# Altium project ADCPrint.PrjPcb
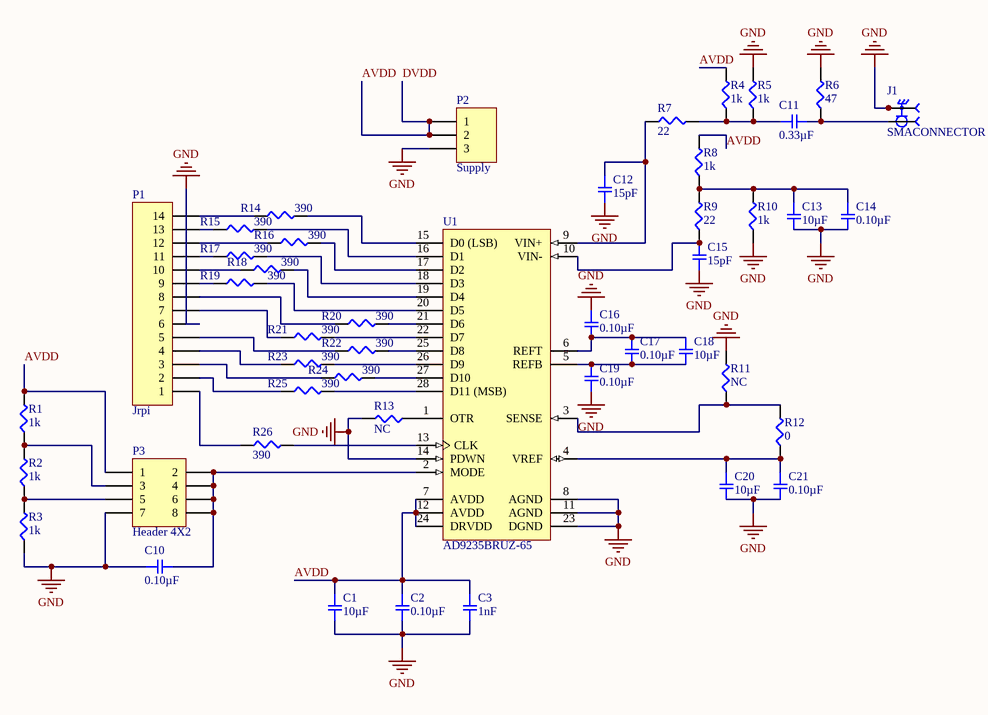
[diagram p0: Sheet1.SchDoc]
1 sheet, 46 parts. Net scope: global (net labels, ports and power ports of the same name join across sheets).
Board file: PCB1.PcbDoc

## Sheet Sheet1.SchDoc
size A4

### Parts
C1  10µF  [SMD-0603C]
C2  0.10µF  [SMD-0603C]
C3  1nF  [SMD-0603C]
C10  0.10µF  [SMD-0603C]
C11  0.33µF  [SMD-0603C]
C12  15pF  [SMD-0603C]
C13  10µF  [SMD-0603C]
C14  0.10µF  [SMD-0603C]
C15  15pF  [SMD-0603C]
C16  0.10µF  [SMD-0603C]
C17  0.10µF  [SMD-0603C]
C18  10µF  [SMD-0603C]
C19  0.10µF  [SMD-0603C]
C20  10µF  [SMD-0603C]
C21  0.10µF  [SMD-0603C]
J1  SMACONNECTOR  [LPRS_SMACONNECTOR]
P1  Jrpi  [HDR1X14]
P2  Supply  [HDR1X3]
P3  Header 4X2  [HDR2X4]
R1  1k  [SMD-0603-RES]
R2  1k  [SMD-0603-RES]
R3  1k  [SMD-0603-RES]
R4  1k  [SMD-0603-RES]
R5  1k  [SMD-0603-RES]
R6  47  [SMD-0603-RES]
R7  22  [SMD-0603-RES]
R8  1k  [SMD-0603-RES]
R9  22  [SMD-0603-RES]
R10  1k  [SMD-0603-RES]
R11  NC  [SMD-0603-RES]
R12  0  [SMD-0603-RES]
R13  NC  [SMD-0603-RES]
R14  390  [SMD-0603-RES]
R15  390  [SMD-0603-RES]
R16  390  [SMD-0603-RES]
R17  390  [SMD-0603-RES]
R18  390  [SMD-0603-RES]
R19  390  [SMD-0603-RES]
R20  390  [SMD-0603-RES]
R21  390  [SMD-0603-RES]
R22  390  [SMD-0603-RES]
R23  390  [SMD-0603-RES]
R24  390  [SMD-0603-RES]
R25  390  [SMD-0603-RES]
R26  390  [SMD-0603-RES]
U1  AD9235BRUZ-65  [RU-28_M]

### Nets
GND: C1.2 C2.2 C3.2 C10.1 C12.2 C13.2 C14.2 C15.2 C16.1 C19.2 C20.2 C21.2 J1.2 J1.3 J1.4 J1.5 P1.6 P2.3 P3.7 R3.1 R5.2 R6.2 R10.1 R11.2 R13.2 U1.8(AGND) U1.11(AGND) U1.14(PDWN) U1.23(DGND)
AVDD: C1.1 C2.1 C3.1 P2.1 P2.2 P3.1 R1.2 R4.2 R8.2 U1.7(AVDD) U1.12(AVDD) U1.24(DRVDD)  [also labelled DVDD]
NetC10_2: C10.2 P3.2 P3.4 P3.6 P3.8 U1.2(MODE)
NetC11_1: C11.1 R4.1 R5.1 R7.2
NetC11_2: C11.2 J1.1 R6.1
NetC12_1: C12.1 R7.1 U1.9(VIN+)
NetC13_1: C13.1 C14.1 R8.1 R9.2 R10.2
NetC15_1: C15.1 R9.1 U1.10(VIN-)
NetC16_2: C16.2 C17.1 C18.1 U1.6(REFT)
NetC17_2: C17.2 C18.2 C19.1 U1.5(REFB)
NetC20_1: C20.1 C21.1 R12.1 U1.4(VREF)
NetP1_1: P1.1 R26.1
NetP1_2: P1.2 R25.1
NetP1_3: P1.3 R24.1
NetP1_4: P1.4 R23.1
NetP1_5: P1.5 R22.1
NetP1_7: P1.7 R21.1
NetP1_8: P1.8 R20.1
NetP1_9: P1.9 R19.1
NetP1_10: P1.10 R18.1
NetP1_11: P1.11 R17.1
NetP1_12: P1.12 R16.1
NetP1_13: P1.13 R15.1
NetP1_14: P1.14 R14.1
NetP3_3: P3.3 R1.1 R2.2
NetP3_5: P3.5 R2.1 R3.2
NetR11_1: R11.1 R12.2 U1.3(SENSE)
NetR13_1: R13.1 U1.1(OTR)
NetR14_2: R14.2 U1.15(D0_(LSB))
NetR15_2: R15.2 U1.16(D1)
NetR16_2: R16.2 U1.17(D2)
NetR17_2: R17.2 U1.18(D3)
NetR18_2: R18.2 U1.19(D4)
NetR19_2: R19.2 U1.20(D5)
NetR20_2: R20.2 U1.21(D6)
NetR21_2: R21.2 U1.22(D7)
NetR22_2: R22.2 U1.25(D8)
NetR23_2: R23.2 U1.26(D9)
NetR24_2: R24.2 U1.27(D10)
NetR25_2: R25.2 U1.28(D11_(MSB))
NetR26_2: R26.2 U1.13(CLK)

### Library data of the parts
C1 C13 C18 C20 = GRM185R60J106ME15D: CAP CER 10UF 6.3V X5R 0603; Manufacturer: Murata Electronics North America; Factory Stock: 0; Unit Price (USD): 0.36; Minimum Quantity: 1; Tolerance: ±20%; Datasheets: http://www.murata.com/~/media/webrenewal/support/library/catalog/products/capacitor/mlcc/c02e.pdf; Image: //media.digikey.com/Renders/Murata%20Renders/ZRB-SERIES-0402.jpg; Digi-Key Part Number: 490-10467-1-ND; Part Number: GRM185R60J106ME15D; Quantity Available: 25068; @ qty: 0; Packaging: Cut Tape (CT); Series: GRM; Part Status: Active; Value: 10µF; Voltage: 6.3V; Temperature Coefficient: X5R; Operating Temperature: -55°C ~ 85°C; Features: Derating Recommended; Ratings: -; Applications: General Purpose; Mounting Type: Surface Mount, MLCC; Package / Case: 0603 (1608 Metric); Size / Dimension: 0.063" L x 0.031" W (1.60mm x 0.80mm); Height - Seated (Max): -; Thickness (Max): 0.022" (0.55mm); Lead Spacing: -; Lead Style: -
C2 C10 C14 C16 C17 C19 C21 = GCJ188R71C104KA01D: CAP CER 0.1UF 16V X7R 0603; Manufacturer: Murata Electronics North America; Factory Stock: 0; Unit Price (USD): 0.21; Minimum Quantity: 1; Tolerance: ±10%; Datasheets: http://www.murata.com/~/media/webrenewal/support/library/catalog/products/capacitor/mlcc/c03e.ashx; Image: //media.digikey.com/Renders/Murata%20Renders/0603%28LQG18%29.jpg; Digi-Key Part Number: 490-5796-1-ND; Part Number: GCJ188R71C104KA01D; Quantity Available: 22473; @ qty: 0; Packaging: Cut Tape (CT); Series: GCJ; Part Status: Active; Value: 0.10µF; Voltage: 16V; Temperature Coefficient: X7R; Operating Temperature: -55°C ~ 125°C; Features: Soft Termination; Ratings: AEC-Q200; Applications: Automotive, Boardflex Sensitive; Mounting Type: Surface Mount, MLCC; Package / Case: 0603 (1608 Metric); Size / Dimension: 0.063" L x 0.031" W (1.60mm x 0.80mm); Height - Seated (Max): -; Thickness (Max): 0.035" (0.90mm); Lead Spacing: -; Lead Style: -
C3 = GCJ188R71H102KA01D: CAP CER 1000PF 50V X7R 0603; Manufacturer: Murata Electronics North America; Factory Stock: 0; Unit Price (USD): 0.16; Minimum Quantity: 1; Tolerance: ±10%; Datasheets: http://www.murata.com/~/media/webrenewal/support/library/catalog/products/capacitor/mlcc/c03e.ashx; Image: //media.digikey.com/Renders/Murata%20Renders/0603%28LQG18%29.jpg; Digi-Key Part Number: 490-5768-1-ND; Part Number: GCJ188R71H102KA01D; Quantity Available: 21434; @ qty: 0; Packaging: Cut Tape (CT); Series: GCJ; Part Status: Active; Value: 1000pF; Voltage: 50V; Temperature Coefficient: X7R; Operating Temperature: -55°C ~ 125°C; Features: Soft Termination; Ratings: AEC-Q200; Applications: Automotive, Boardflex Sensitive; Mounting Type: Surface Mount, MLCC; Package / Case: 0603 (1608 Metric); Size / Dimension: 0.063" L x 0.031" W (1.60mm x 0.80mm); Height - Seated (Max): -; Thickness (Max): 0.031" (0.80mm); Lead Spacing: -; Lead Style: -
C11 = GCM188R71C334KA37D: CAP CER 0.33UF 16V X7R 0603; Manufacturer: Murata Electronics North America; Factory Stock: 0; Unit Price (USD): 0.19; Minimum Quantity: 1; Tolerance: ±10%; Datasheets: http://www.murata.com/~/media/webrenewal/support/library/catalog/products/capacitor/mlcc/c03e.ashx; Image: //media.digikey.com/Renders/Murata%20Renders/0603%28GCM188%29.jpg; Digi-Key Part Number: 490-6050-1-ND; Part Number: GCM188R71C334KA37D; Quantity Available: 10234; @ qty: 0; Packaging: Cut Tape (CT); Series: GCM; Part Status: Active; Value: 0.33µF; Voltage: 16V; Temperature Coefficient: X7R; Operating Temperature: -55°C ~ 125°C; Features: -; Ratings: AEC-Q200; Applications: Automotive; Mounting Type: Surface Mount, MLCC; Package / Case: 0603 (1608 Metric); Size / Dimension: 0.063" L x 0.031" W (1.60mm x 0.80mm); Height - Seated (Max): -; Thickness (Max): 0.035" (0.90mm); Lead Spacing: -; Lead Style: -
C12 C15 = GCM1885C1H150JA16D: CAP CER 15PF 50V NP0 0603; Manufacturer: Murata Electronics North America; Factory Stock: 0; Unit Price (USD): 0.1; Minimum Quantity: 1; Tolerance: ±5%; Temperature Coefficient: C0G, NP0; Datasheets: http://www.murata.com/~/media/webrenewal/support/library/catalog/products/capacitor/mlcc/c03e.ashx; Image: //media.digikey.com/Renders/Murata%20Renders/0603%28GCM188%29.jpg; Digi-Key Part Number: 490-4957-1-ND; Part Number: GCM1885C1H150JA16D; Quantity Available: 99209; @ qty: 0; Packaging: Cut Tape (CT); Series: GCM; Part Status: Active; Value: 15pF; Voltage: 50V; Operating Temperature: -55°C ~ 125°C; Features: -; Ratings: AEC-Q200; Applications: Automotive; Mounting Type: Surface Mount, MLCC; Package / Case: 0603 (1608 Metric); Size / Dimension: 0.063" L x 0.031" W (1.60mm x 0.80mm); Height - Seated (Max): -; Thickness (Max): 0.035" (0.90mm); Lead Spacing: -; Lead Style: -
J1 = SMACONNECTOR: SMA female RF coaxial connector for SMA male RF antennas.; Package: None; Price: None; Value: *; MP: SMACONNECTOR; Availability: Unavailable
P1 = Header 14: Header, 14-Pin; LatestRevisionDate: 17-Jul-2002; LatestRevisionNote: Re-released for DXP Platform.; Publisher: Altium Limited
P2 = Header 3: Header, 3-Pin; LatestRevisionDate: 17-Jul-2002; LatestRevisionNote: Re-released for DXP Platform.; Publisher: Altium Limited
P3 = Header 4X2: Header, 4-Pin, Dual row; LatestRevisionDate: 17-Jul-2002; LatestRevisionNote: Re-released for DXP Platform.; Publisher: Altium Limited
R1-R5 R8 R10 = ERJ-3EKF1001V: RES SMD 1K OHM 1% 1/10W 0603; Manufacturer: Panasonic Electronic Components; Factory Stock: 0; Unit Price (USD): 0.00379; @ qty: 1500; Minimum Quantity: 1; Power (Watts): 0.1W, 1/10W; Temperature Coefficient: ±100ppm/°C; Part Number: ERJ-3EKF1001V; Datasheets: http://industrial.panasonic.com/www-cgi/jvcr13pz.cgi?E+PZ+3+AOA0002+ERJ3EKF1001V+7+WW; Image: //media.digikey.com/Photos/Panasonic%20Photos/MFG_ERJ-P6W%20Series.jpg; Digi-Key Part Number: P1.00KHCT-ND; Quantity Available: 5218845; Packaging: Cut Tape (CT); Series: ERJ; Part Status: Active; Value: 1k; Tolerance: ±1%; Composition: Thick Film; Features: Automotive AEC-Q200; Operating Temperature: -55°C ~ 155°C; Package / Case: 0603 (1608 Metric); Supplier Device Package: 0603; Size / Dimension: 0.063" L x 0.031" W (1.60mm x 0.80mm); Height - Seated (Max): 0.022" (0.55mm); Number of Terminations: 2; Failure Rate: -
R6 = ERJ-PA3F47R0V: RES SMD 47 OHM 1% 1/4W 0603; Manufacturer: Panasonic Electronic Components; Factory Stock: 0; Unit Price (USD): 0.02372; @ qty: 1500; Minimum Quantity: 1; Power (Watts): 0.25W, 1/4W; Temperature Coefficient: ±100ppm/°C; Part Number: ERJ-PA3F47R0V; Datasheets: https://industrial.panasonic.com/cdbs/www-data/pdf/RDA0000/AOA0000C243.pdf; Image: //media.digikey.com/Photos/Panasonic%20Photos/MFG_ERJ-P6W%20Series.jpg; Digi-Key Part Number: P47.00BYCT-ND; Quantity Available: 13707; Packaging: Cut Tape (CT); Series: ERJ; Part Status: Active; Value: 47; Tolerance: ±1%; Composition: Thick Film; Features: Automotive AEC-Q200, Pulse Withstanding; Operating Temperature: -55°C ~ 155°C; Package / Case: 0603 (1608 Metric); Supplier Device Package: 0603; Size / Dimension: 0.063" L x 0.031" W (1.60mm x 0.80mm); Height - Seated (Max): 0.022" (0.55mm); Number of Terminations: 2; Failure Rate: -
R7 R9 = ERJ-3GEYJ220V: RES SMD 22 OHM 5% 1/10W 0603; Manufacturer: Panasonic Electronic Components; Factory Stock: 0; Unit Price (USD): 0.00321; @ qty: 1500; Minimum Quantity: 1; Power (Watts): 0.1W, 1/10W; Temperature Coefficient: ±200ppm/°C; Part Number: ERJ-3GEYJ220V; Datasheets: http://industrial.panasonic.com/www-cgi/jvcr13pz.cgi?E+PZ+3+AOA0001+ERJ3GEYJ220V+7+WW; Image: //media.digikey.com/Photos/Panasonic%20Photos/MFG_ERJ-P6W%20Series.jpg; Digi-Key Part Number: P22GCT-ND; Quantity Available: 349892; Packaging: Cut Tape (CT); Series: ERJ; Part Status: Active; Value: 22; Tolerance: ±5%; Composition: Thick Film; Features: Automotive AEC-Q200; Operating Temperature: -55°C ~ 155°C; Package / Case: 0603 (1608 Metric); Supplier Device Package: 0603; Size / Dimension: 0.063" L x 0.031" W (1.60mm x 0.80mm); Height - Seated (Max): 0.022" (0.55mm); Number of Terminations: 2; Failure Rate: -
R11 R13 = ERJ-3BWFR020V: RES SMD 0.02 OHM 1% 1/3W 0603; Manufacturer: Panasonic Electronic Components; Factory Stock: 0; Unit Price (USD): 0.07040; @ qty: 1500; Minimum Quantity: 1; Value: 0.02; Power (Watts): 0.333W, 1/3W; Temperature Coefficient: ±250ppm/°C; Part Number: ERJ-3BWFR020V; Datasheets: https://industrial.panasonic.com/cdbs/www-data/pdf/RDA0000/AOA0000C239.pdf; Image: //media.digikey.com/Photos/Panasonic%20Photos/MFG_ERJ-P6W%20Series.jpg; Digi-Key Part Number: P17461CT-ND; Quantity Available: 4366; Packaging: Cut Tape (CT); Series: ERJ; Part Status: Active; Tolerance: ±1%; Composition: Thick Film; Features: Automotive AEC-Q200, Current Sense; Operating Temperature: -55°C ~ 155°C; Package / Case: 0603 (1608 Metric); Supplier Device Package: 0603; Size / Dimension: 0.063" L x 0.031" W (1.60mm x 0.80mm); Height - Seated (Max): 0.026" (0.65mm); Number of Terminations: 2; Failure Rate: -
R12 = ERJ-3BWFR020V: RES SMD 0.02 OHM 1% 1/3W 0603; Manufacturer: Panasonic Electronic Components; Unit Price (USD): 0.07040; @ qty: 1500; Minimum Quantity: 1; Value: 0.02; Power (Watts): 0.333W, 1/3W; Temperature Coefficient: ±250ppm/°C; Part Number: ERJ-3BWFR020V; Datasheets: https://industrial.panasonic.com/cdbs/www-data/pdf/RDA0000/AOA0000C239.pdf; Image: //media.digikey.com/Photos/Panasonic%20Photos/MFG_ERJ-P6W%20Series.jpg; Digi-Key Part Number: P17461CT-ND; Quantity Available: 4366; Factory Stock: 0; Packaging: Cut Tape (CT); Series: ERJ; Part Status: Active; Tolerance: ±1%; Composition: Thick Film; Features: Automotive AEC-Q200, Current Sense; Operating Temperature: -55°C ~ 155°C; Package / Case: 0603 (1608 Metric); Supplier Device Package: 0603; Size / Dimension: 0.063" L x 0.031" W (1.60mm x 0.80mm); Height - Seated (Max): 0.026" (0.65mm); Number of Terminations: 2; Failure Rate: -
R14-R26 = ERJ-3EKF3900V: RES SMD 390 OHM 1% 1/10W 0603; Manufacturer: Panasonic Electronic Components; Factory Stock: 0; Unit Price (USD): 0.00379; @ qty: 1500; Minimum Quantity: 1; Power (Watts): 0.1W, 1/10W; Temperature Coefficient: ±100ppm/°C; Part Number: ERJ-3EKF3900V; Datasheets: http://industrial.panasonic.com/www-cgi/jvcr13pz.cgi?E+PZ+3+AOA0002+ERJ3EKF3900V+7+WW; Image: //media.digikey.com/Photos/Panasonic%20Photos/MFG_ERJ-P6W%20Series.jpg; Digi-Key Part Number: P390HCT-ND; Quantity Available: 87884; Packaging: Cut Tape (CT); Series: ERJ; Part Status: Active; Value: 390; Tolerance: ±1%; Composition: Thick Film; Features: Automotive AEC-Q200; Operating Temperature: -55°C ~ 155°C; Package / Case: 0603 (1608 Metric); Supplier Device Package: 0603; Size / Dimension: 0.063" L x 0.031" W (1.60mm x 0.80mm); Height - Seated (Max): 0.022" (0.55mm); Number of Terminations: 2; Failure Rate: -
U1 = CMP-0313-01750-2: Single 12-Bit Analog-to-Digital Converter with Parallel Interface, 65MSPS, -40 to +85 degC, RU-28, Pb-Free, Tube; Generic Part Number: AD9235-65; Manufacturer: Analog Devices; Resolution (Bits): 12; Interface: Par; Channels: 1; Throughput Rate (SPS): 65M; Mounting Technology: Surface Mount; DatasheetVersion: Rev.C; RoHS: Y; ComponentLink2Description: Datasheet; PartNumber: AD9235BRUZ-65; ComponentLink1URL: http://www.analog.com/en/index.html; PackageDescription: 28-Lead Thin Shrink Small Outline Package [TSSOP]; Packing: Tube; ComponentLink4URL: http://www.analog.com/en/analog-to-digital-converters/ad-converters/ad9235/products/product.html; Code_JEDEC: MO-153-AE; PackageVersion: 2005; ComponentLink3URL: http://www.analog.com/static/imported-files/packages/249854663RU_28.pdf; ComponentLink1Description: Manufacturer URL; PackageReference: RU-28; ComponentLink2URL: http://www.analog.com/static/imported-files/data_sheets/AD9235.pdf; ComponentLink4Description: Product URL; ComponentLink3Description: Package Specification